# Altium schematic sheet GEX_Radio.SchDoc: GEX Wireless Dongle
size A4; Date: 4/2018; Author: MightyPork; Revision: 0.1
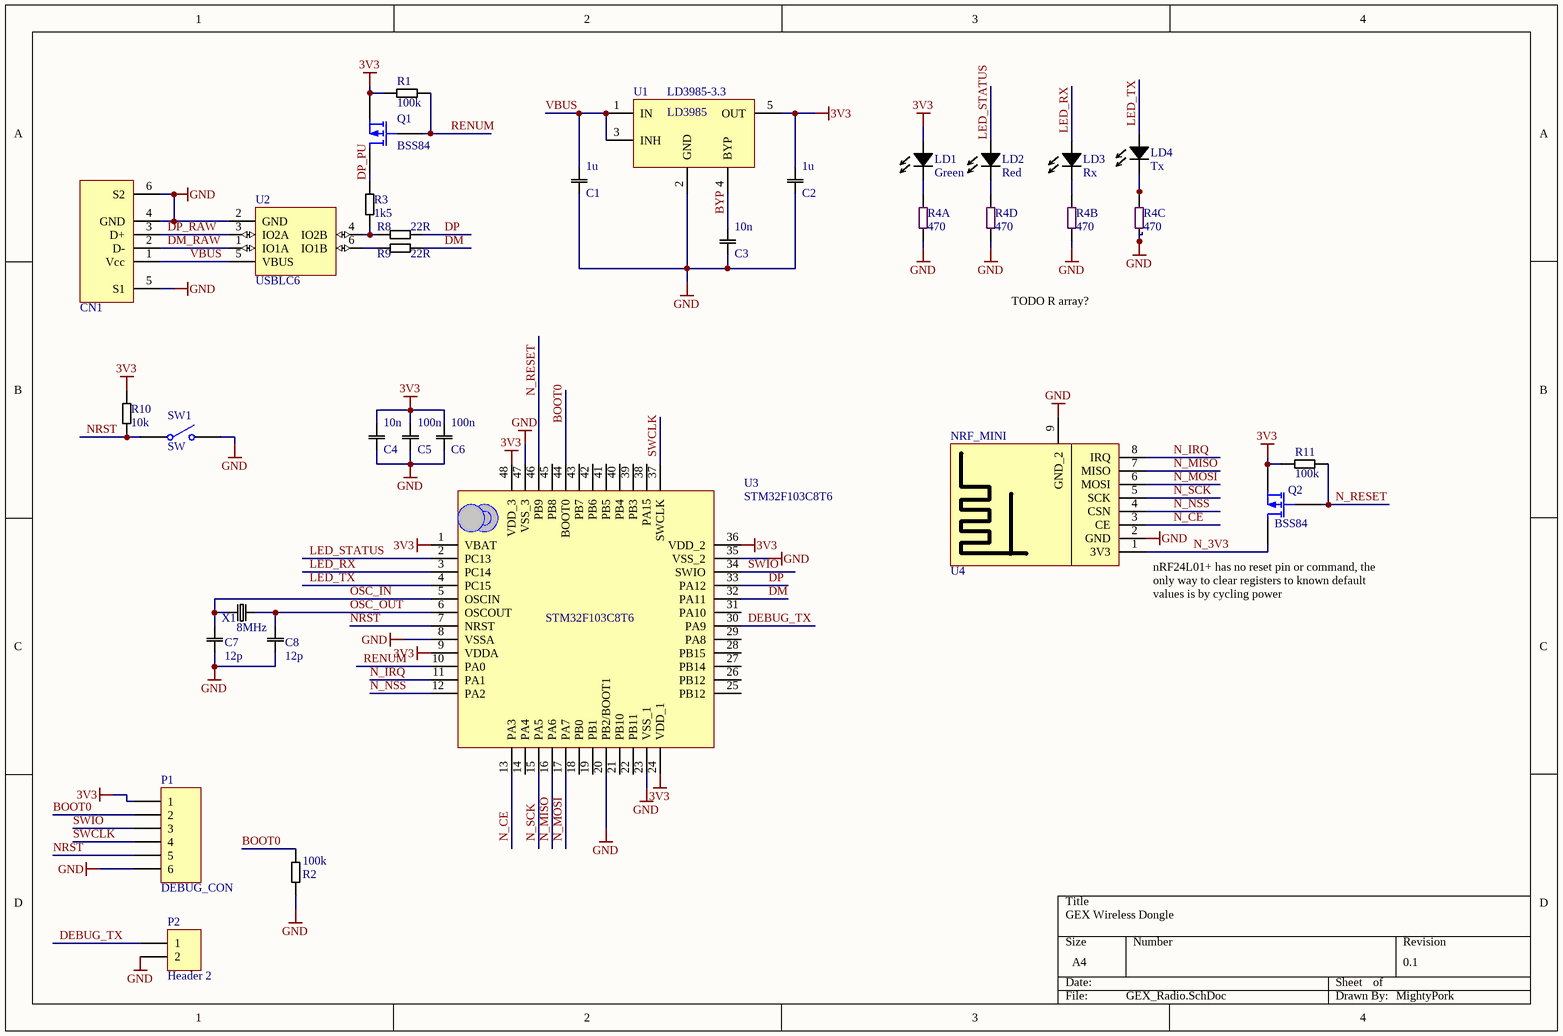
[diagram p0: GEX_Radio.SchDoc]

## Parts
C1  1u  [C0805]
C2  1u  [C0805]
C3  10n  [C0805]
C4  10n  [C0805]
C5  100n  [C0805]
C6  100n  [C0805]
C7  12p  [C0805]
C8  12p  [C0805]
CN1  USB_A  [USB_A]  (value not drawn)
LD1  Green  [LED_SMD]
LD2  Red  [LED_SMD]
LD3  Rx  [LED_SMD]
LD4  Tx  [LED_SMD]
P1  DEBUG_CON  [Header_6_2mm]
P2  value Header 2  [Header_2_2mm]  (hidden comment: Header_2)
Q1  BSS84  [SOT23]
Q2  BSS84  [SOT23]
R1  100k  [R0805]
R2  100k  [R0805]
R3  1k5  [R0805]
R4  470  [R1206_Array_longpad]  (parts A,B,C,D of 4)
R8  22R  [R0805]
R9  22R  [R0805]
R10  10k  [R0805]
R11  100k  [R0805]
SW1  SW  [SW_TINY_4PAD]
U1  LD3985-3.3  [SOT23-5]
U2  USBLC6  [SOT23-6]
U3  STM32F103C8T6  [LQFP48_SHORT]
U4  NRF_MINI  [NRF_MINI_NOANTLINES]
X1  8MHz  [XTAL-SMD-50-32]

## Nets
3V3: C2.2 C4.2 C5.2 C6.2 LD1.A P1.1 Q1.2(S) Q2.2(S) R1.2 R10.1 R11.2 U1.5(OUT) U3.1(VBAT) U3.9(VDDA) U3.24(VDD_1) U3.36(VDD_2) U3.48(VDD_3)
GND: C1.1 C2.1 C3.1 C4.1 C5.1 C6.1 C7.1 C8.1 CN1.4(GND) CN1.5(S1) CN1.6(S2) P1.6 P2.2 R2.2 R4.2 R4.4 R4.6 R4.8 SW1.2(NO) U1.2(GND) U2.2(GND) U3.8(VSSA) U3.20(PB2/BOOT1) U3.23(VSS_1) U3.35(VSS_2) U3.47(VSS_3) U4.2(GND) U4.9(GND_2)
BOOT0: P1.2 R2.1 U3.44(BOOT0)
BYP: C3.2 U1.4(BYP)
DEBUG_TX: P2.1 U3.30(PA9)
DM: R9.1 U3.32(PA11)
DM_RAW: CN1.2(D-) U2.1(IO1A)
DP: R8.1 U3.33(PA12)
DP_PU: Q1.3(D) R3.2
DP_RAW: CN1.3(D+) U2.3(IO2A)
LED_RX: LD3.A U3.3(PC14)
LED_STATUS: LD2.A U3.2(PC13)
LED_TX: LD4.A U3.4(PC15)
N_3V3: Q2.3(D) U4.1(3V3)
N_CE: U3.13(PA3) U4.3(CE)
N_IRQ: U3.11(PA1) U4.8(IRQ)
N_MISO: U3.16(PA6) U4.7(MISO)
N_MOSI: U3.17(PA7) U4.6(MOSI)
N_NSS: U3.12(PA2) U4.4(CSN)
N_RESET: Q2.1(G) R11.1 U3.46(PB9)
N_SCK: U3.15(PA5) U4.5(SCK)
NRST: P1.5 R10.2 SW1.1(COMMON) U3.7(NRST)
OSC_IN: C7.2 U3.5(OSCIN) X1.1
OSC_OUT: C8.2 U3.6(OSCOUT) X1.2
RENUM: Q1.1(G) R1.1 U3.10(PA0)
SWCLK: P1.4 U3.37(SWCLK)
SWIO: P1.3 U3.34(SWIO)
VBUS: C1.2 CN1.1(Vcc) U1.1(IN) U1.3(INH) U2.5(VBUS)
NetLD1_C: LD1.C R4.1
NetLD2_C: LD2.C R4.7
NetLD3_C: LD3.C R4.3
NetLD4_C: LD4.C R4.5
NetR3_1: R3.1 R8.2 U2.4(IO2B)
NetR9_2: R9.2 U2.6(IO1B)

Not connected (* = marked no-connect by the designer): U3 14(PA4) 18(PB0) 19(PB1) 21(PB10) 22(PB11) 25(PB12) 26(PB12) 27(PB14) 28(PB15) 29(PA8) 31(PA10) 38(PA15) 39(PB3) 40(PB4) 41(PB5) 42(PB6) 43(PB7) 45(PB8)

## Notes on the sheet
- TODO R array?
- nRF24L01+ has no reset pin or command, the only way to clear registers to known default values is by cycling power

## Library data of the parts
C1-C8 = C: Supplier Part Number 1: any C0805 X7R 50V; Supplier 1: Farnell
  C1 C2: Value: 1u
  C3 C4: Value: 10n
  C5 C6: Value: 100n
  C7 C8: Value: 12p
LD1-LD4 = LED: Value: TBD
P1 = Header 6: Header, 6-Pin; LatestRevisionDate: 17-Jul-2002; LatestRevisionNote: Re-released for DXP Platform.; Publisher: Altium Limited
P2 = Header_2: Header, 2-Pin; Model: 961102-6404-AR; Supplier 1: Farnell; Supplier Part Number 1: 2396217; Supplier 2: GME; Supplier Part Number 2: 832-359
Q1 Q2 = BSS84: P-Channel Enhancement Mode Vertical DMOS FET; Supplier 1: Farnell; Supplier Part Number 1: 1094997; Supplier 2: GME; Supplier Part Number 2: 912-041; HelpURL: http://www.farnell.com/datasheets/1718091.pdf; Model: BSS84; Package: SOT23; Value: BSS84
R1-R3 R8-R11 = R: Supplier Part Number 1: any R0805 1%; Supplier 1: Farnell
  R1 R2 R11: Value: 100k
  R3: Value: 1k5
  R8 R9: Value: 22R
  R10: Value: 10k
R4 = R_ARRAY: Value: 470
SW1 = SW_SPST_4PAD
U1 = LD3985
U2 = USBLC6_ESD
X1 = XTALL: Value: 8MHz